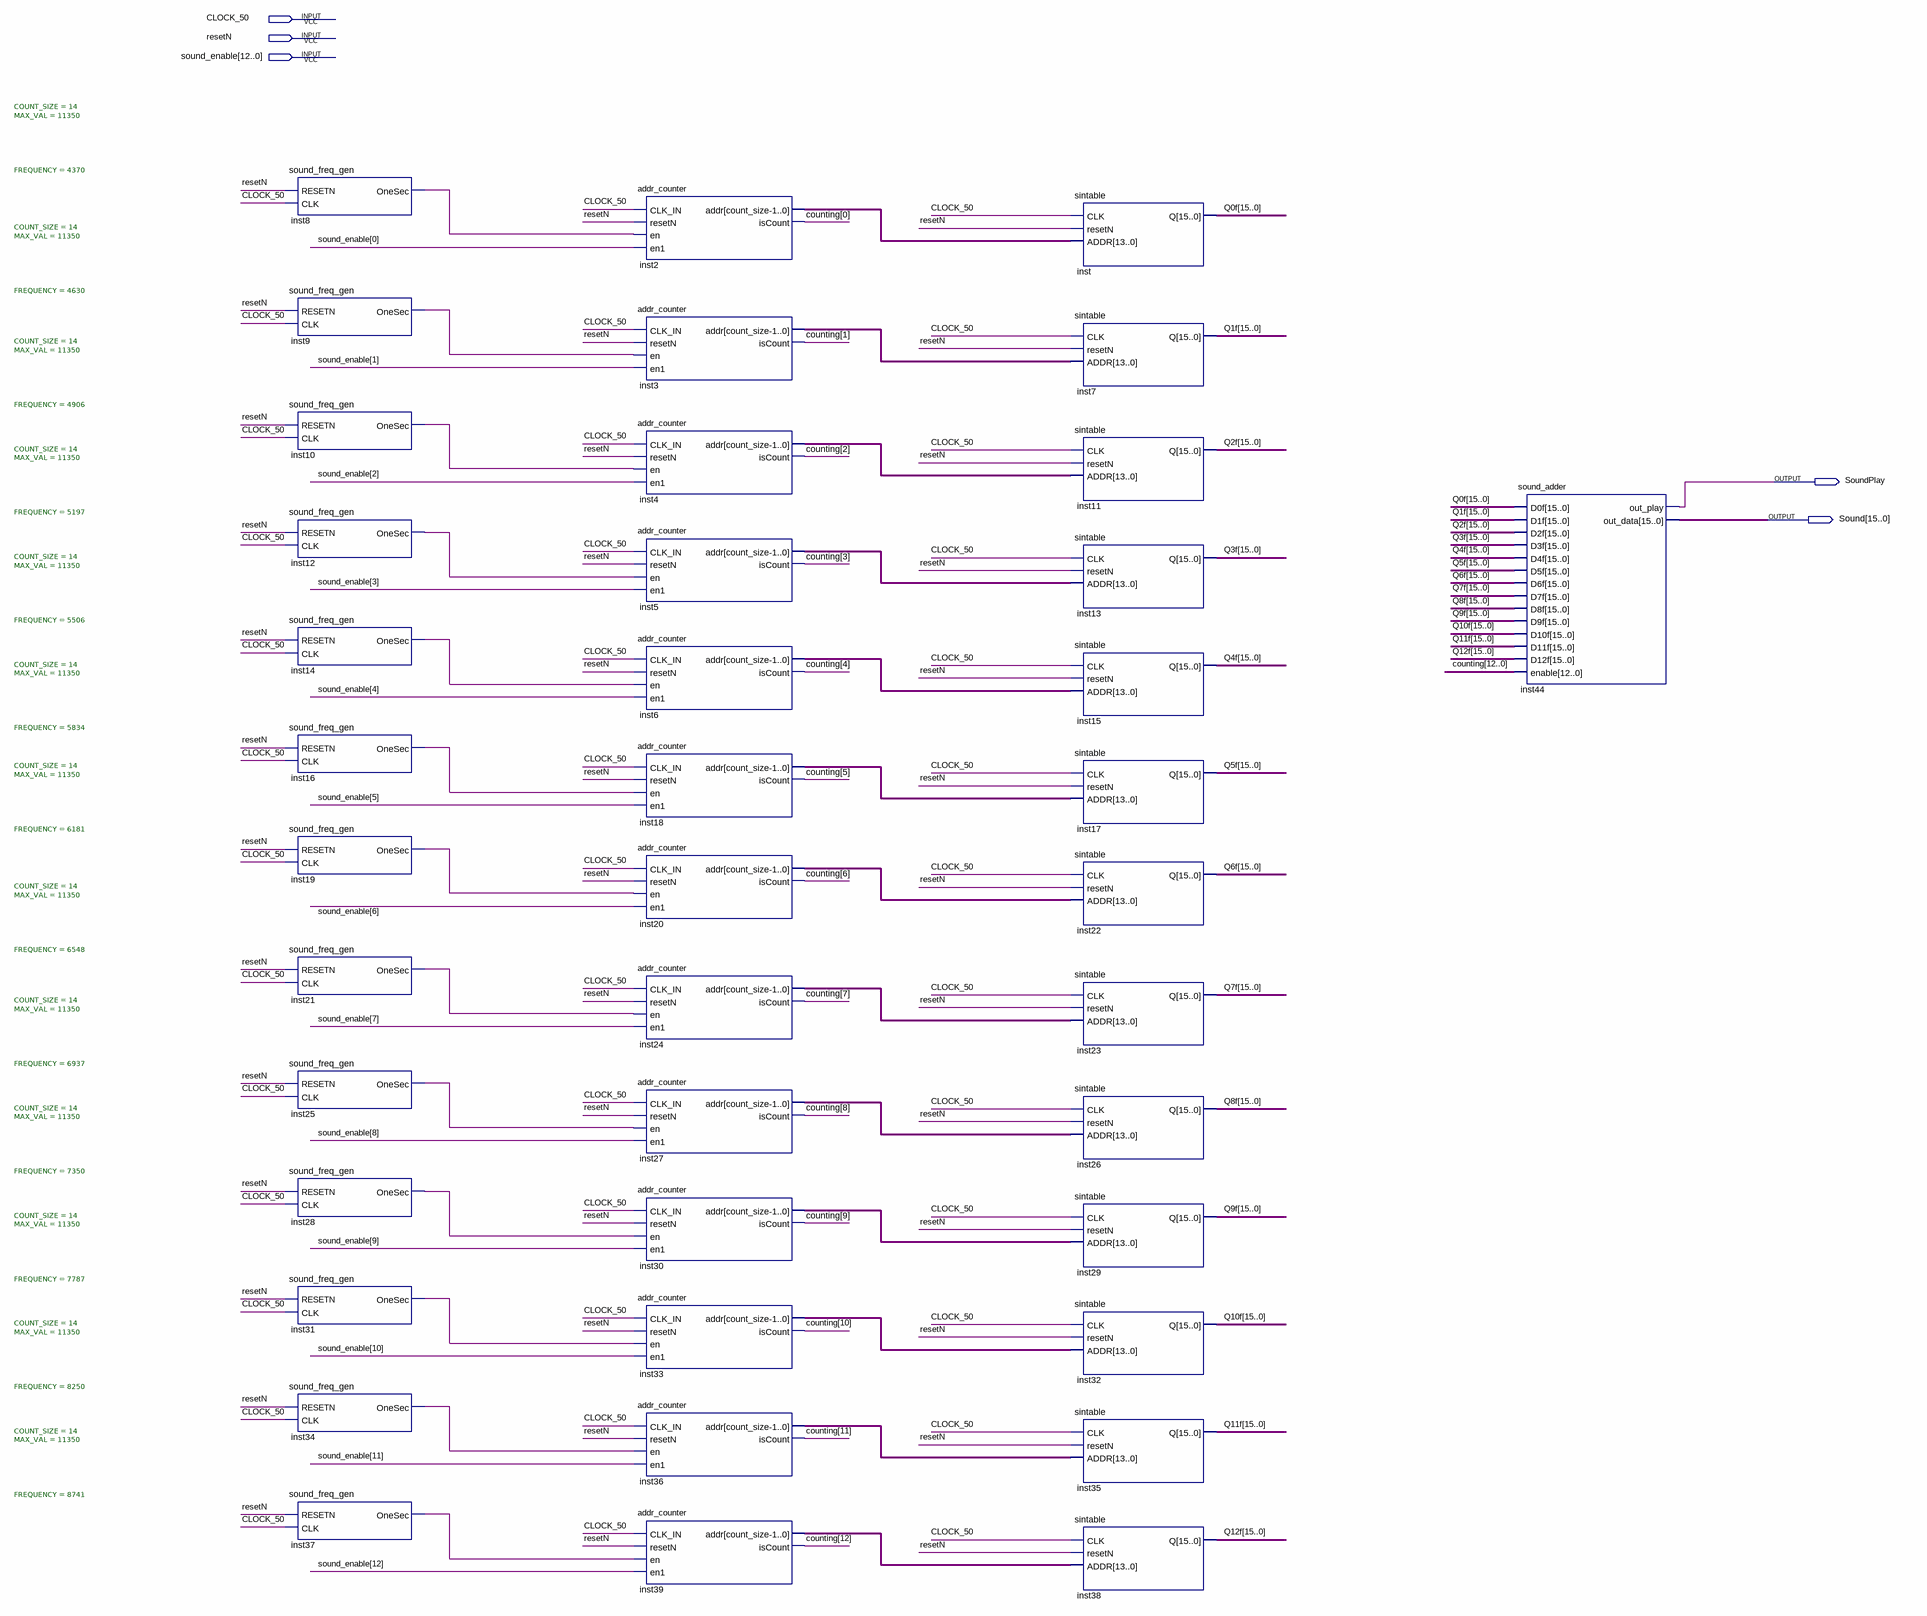
[diagram p0: schematic sheet]
// Quartus schematic Note_All_Block.bdf as structural Verilog: 40 symbols, 5 pins
module Note_All_Block (
  input  CLOCK_50,
  input  resetN,
  input  [12:0] sound_enable,
  output SoundPlay,
  output [15:0] Sound
);

  wire inst8_onesec, inst9_onesec, inst10_onesec, inst12_onesec, inst14_onesec, inst16_onesec, inst19_onesec,
       inst21_onesec, inst25_onesec, inst28_onesec, inst31_onesec, inst34_onesec, inst37_onesec;
  wire [12:0] counting;
  wire [13:0] inst2_addr, inst3_addr, inst4_addr, inst5_addr, inst6_addr, inst18_addr, inst20_addr,
       inst24_addr, inst27_addr, inst30_addr, inst33_addr, inst36_addr, inst39_addr;
  wire [15:0] Q0f, Q1f, Q2f, Q3f, Q4f, Q5f, Q6f, Q7f, Q8f, Q9f, Q10f, Q11f, Q12f;

  sound_freq_gen #(.FREQUENCY(4370)) inst8 (.RESETN(resetN), .CLK(CLOCK_50), .OneSec(inst8_onesec));
  sound_freq_gen #(.FREQUENCY(4630)) inst9 (.RESETN(resetN), .CLK(CLOCK_50), .OneSec(inst9_onesec));
  sound_freq_gen #(.FREQUENCY(4906)) inst10 (.RESETN(resetN), .CLK(CLOCK_50), .OneSec(inst10_onesec));
  sound_freq_gen #(.FREQUENCY(5197)) inst12 (.RESETN(resetN), .CLK(CLOCK_50), .OneSec(inst12_onesec));
  sound_freq_gen #(.FREQUENCY(5506)) inst14 (.RESETN(resetN), .CLK(CLOCK_50), .OneSec(inst14_onesec));
  sound_freq_gen #(.FREQUENCY(5834)) inst16 (.RESETN(resetN), .CLK(CLOCK_50), .OneSec(inst16_onesec));
  sound_freq_gen #(.FREQUENCY(6181)) inst19 (.RESETN(resetN), .CLK(CLOCK_50), .OneSec(inst19_onesec));
  sound_freq_gen #(.FREQUENCY(6548)) inst21 (.RESETN(resetN), .CLK(CLOCK_50), .OneSec(inst21_onesec));
  sound_freq_gen #(.FREQUENCY(6937)) inst25 (.RESETN(resetN), .CLK(CLOCK_50), .OneSec(inst25_onesec));
  sound_freq_gen #(.FREQUENCY(7350)) inst28 (.RESETN(resetN), .CLK(CLOCK_50), .OneSec(inst28_onesec));
  sound_freq_gen #(.FREQUENCY(7787)) inst31 (.RESETN(resetN), .CLK(CLOCK_50), .OneSec(inst31_onesec));
  sound_freq_gen #(.FREQUENCY(8250)) inst34 (.RESETN(resetN), .CLK(CLOCK_50), .OneSec(inst34_onesec));
  sound_freq_gen #(.FREQUENCY(8741)) inst37 (.RESETN(resetN), .CLK(CLOCK_50), .OneSec(inst37_onesec));
  addr_counter #(.COUNT_SIZE(14), .MAX_VAL(11350)) inst2 (
    .CLK_IN(CLOCK_50), .resetN(resetN), .en(inst8_onesec), .en1(sound_enable[0]), .addr(inst2_addr),
    .isCount(counting[0]));
  addr_counter #(.COUNT_SIZE(14), .MAX_VAL(11350)) inst3 (
    .CLK_IN(CLOCK_50), .resetN(resetN), .en(inst9_onesec), .en1(sound_enable[1]), .addr(inst3_addr),
    .isCount(counting[1]));
  addr_counter #(.COUNT_SIZE(14), .MAX_VAL(11350)) inst4 (
    .CLK_IN(CLOCK_50), .resetN(resetN), .en(inst10_onesec), .en1(sound_enable[2]), .addr(inst4_addr),
    .isCount(counting[2]));
  addr_counter #(.COUNT_SIZE(14), .MAX_VAL(11350)) inst5 (
    .CLK_IN(CLOCK_50), .resetN(resetN), .en(inst12_onesec), .en1(sound_enable[3]), .addr(inst5_addr),
    .isCount(counting[3]));
  addr_counter #(.COUNT_SIZE(14), .MAX_VAL(11350)) inst6 (
    .CLK_IN(CLOCK_50), .resetN(resetN), .en(inst14_onesec), .en1(sound_enable[4]), .addr(inst6_addr),
    .isCount(counting[4]));
  addr_counter #(.COUNT_SIZE(14), .MAX_VAL(11350)) inst18 (
    .CLK_IN(CLOCK_50), .resetN(resetN), .en(inst16_onesec), .en1(sound_enable[5]), .addr(inst18_addr),
    .isCount(counting[5]));
  addr_counter #(.COUNT_SIZE(14), .MAX_VAL(11350)) inst20 (
    .CLK_IN(CLOCK_50), .resetN(resetN), .en(inst19_onesec), .en1(sound_enable[6]), .addr(inst20_addr),
    .isCount(counting[6]));
  addr_counter #(.COUNT_SIZE(14), .MAX_VAL(11350)) inst24 (
    .CLK_IN(CLOCK_50), .resetN(resetN), .en(inst21_onesec), .en1(sound_enable[7]), .addr(inst24_addr),
    .isCount(counting[7]));
  addr_counter #(.COUNT_SIZE(14), .MAX_VAL(11350)) inst27 (
    .CLK_IN(CLOCK_50), .resetN(resetN), .en(inst25_onesec), .en1(sound_enable[8]), .addr(inst27_addr),
    .isCount(counting[8]));
  addr_counter #(.COUNT_SIZE(14), .MAX_VAL(11350)) inst30 (
    .CLK_IN(CLOCK_50), .resetN(resetN), .en(inst28_onesec), .en1(sound_enable[9]), .addr(inst30_addr),
    .isCount(counting[9]));
  addr_counter #(.COUNT_SIZE(14), .MAX_VAL(11350)) inst33 (
    .CLK_IN(CLOCK_50), .resetN(resetN), .en(inst31_onesec), .en1(sound_enable[10]), .addr(inst33_addr),
    .isCount(counting[10]));
  addr_counter #(.COUNT_SIZE(14), .MAX_VAL(11350)) inst36 (
    .CLK_IN(CLOCK_50), .resetN(resetN), .en(inst34_onesec), .en1(sound_enable[11]), .addr(inst36_addr),
    .isCount(counting[11]));
  addr_counter #(.COUNT_SIZE(14), .MAX_VAL(11350)) inst39 (
    .CLK_IN(CLOCK_50), .resetN(resetN), .en(inst37_onesec), .en1(sound_enable[12]), .addr(inst39_addr),
    .isCount(counting[12]));
  sintable inst (.CLK(CLOCK_50), .resetN(resetN), .ADDR(inst2_addr), .Q(Q0f));
  sintable inst7 (.CLK(CLOCK_50), .resetN(resetN), .ADDR(inst3_addr), .Q(Q1f));
  sintable inst11 (.CLK(CLOCK_50), .resetN(resetN), .ADDR(inst4_addr), .Q(Q2f));
  sintable inst13 (.CLK(CLOCK_50), .resetN(resetN), .ADDR(inst5_addr), .Q(Q3f));
  sintable inst15 (.CLK(CLOCK_50), .resetN(resetN), .ADDR(inst6_addr), .Q(Q4f));
  sintable inst17 (.CLK(CLOCK_50), .resetN(resetN), .ADDR(inst18_addr), .Q(Q5f));
  sintable inst22 (.CLK(CLOCK_50), .resetN(resetN), .ADDR(inst20_addr), .Q(Q6f));
  sintable inst23 (.CLK(CLOCK_50), .resetN(resetN), .ADDR(inst24_addr), .Q(Q7f));
  sintable inst26 (.CLK(CLOCK_50), .resetN(resetN), .ADDR(inst27_addr), .Q(Q8f));
  sintable inst29 (.CLK(CLOCK_50), .resetN(resetN), .ADDR(inst30_addr), .Q(Q9f));
  sintable inst32 (.CLK(CLOCK_50), .resetN(resetN), .ADDR(inst33_addr), .Q(Q10f));
  sintable inst35 (.CLK(CLOCK_50), .resetN(resetN), .ADDR(inst36_addr), .Q(Q11f));
  sintable inst38 (.CLK(CLOCK_50), .resetN(resetN), .ADDR(inst39_addr), .Q(Q12f));
  sound_adder inst44 (
    .D0f(Q0f), .D1f(Q1f), .D2f(Q2f), .D3f(Q3f), .D4f(Q4f), .D5f(Q5f), .D6f(Q6f), .D7f(Q7f), .D8f(Q8f),
    .D9f(Q9f), .D10f(Q10f), .D11f(Q11f), .D12f(Q12f), .enable(counting), .out_play(SoundPlay),
    .out_data(Sound));
endmodule
